# EAGLE design CIC_Arduino_Adapter (EAGLE 6.1)
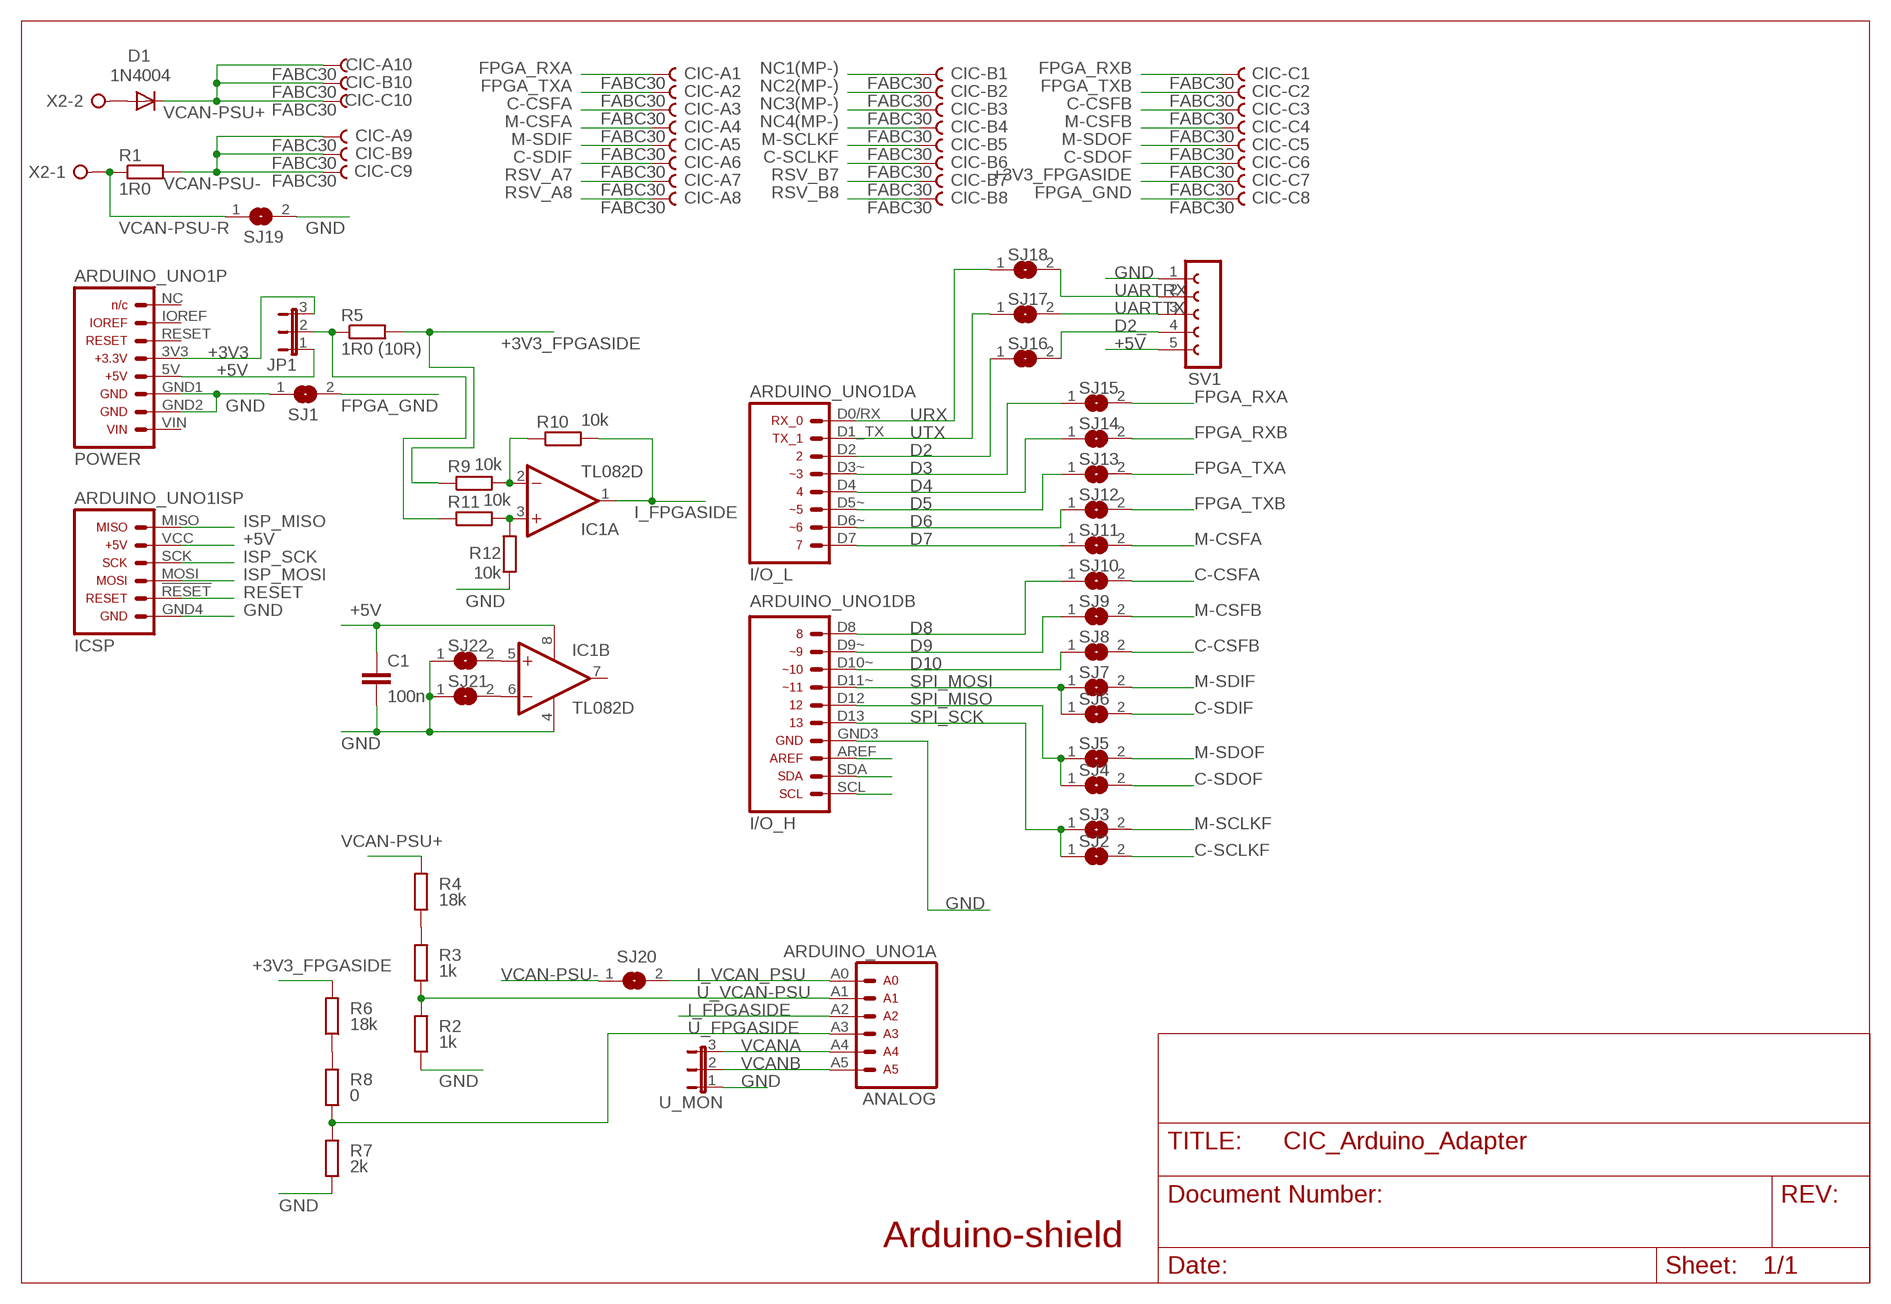
[diagram p0: schematic, sheet 1]

## Parts
ARDUINO_UNO1  SHELL_UNO1  [SHELL_UNO_1]
C1  100n  C-EUC0805  [C0805]
CIC  FABC30  [FABC30]
D1  1N4004  [DO41-10]
IC1  TL082D  [SO08]
JP1  JP2E  [JP2]
R1  1R0  R-EU_0207/2V  [0207/2V]
R2  1k  R-EU_0207/2V  [0207/2V]
R3  1k  R-EU_0207/2V  [0207/2V]
R4  18k  R-EU_0207/2V  [0207/2V]
R5  1R0 (10R)  R-EU_0207/2V  [0207/2V]
R6  18k  R-EU_0207/2V  [0207/2V]
R7  2k  R-EU_0207/2V  [0207/2V]
R8  0  R-EU_0207/2V  [0207/2V]
R9  10k  R-EU_R0805  [R0805]
R10  10k  R-EU_R0805  [R0805]
R11  10k  R-EU_R0805  [R0805]
R12  10k  R-EU_R0805  [R0805]
SJ1  SJ  [SJ]
SJ2  SJ  [SJ]
SJ3  SJ  [SJ]
SJ4  SJ  [SJ]
SJ5  SJ  [SJ]
SJ6  SJ  [SJ]
SJ7  SJ  [SJ]
SJ8  SJ  [SJ]
SJ9  SJ  [SJ]
SJ10  SJ  [SJ]
SJ11  SJ  [SJ]
SJ12  SJ  [SJ]
SJ13  SJ  [SJ]
SJ14  SJ  [SJ]
SJ15  SJ  [SJ]
SJ16  SJ  [SJ]
SJ17  SJ  [SJ]
SJ18  SJ  [SJ]
SJ19  SJ  [SJ]
SJ20  SJ  [SJ]
SJ21  SJ  [SJ]
SJ22  SJ  [SJ]
SV1  FE05-1  [FE05-1]
U_MON  JP2E  [JP2]
X2  W237-2N  [W237-2N]

## Nets
+3V3: ARDUINO_UNO1.3V3 JP1.3
+3V3_FPGASIDE: CIC.C7 R5.2 R6.2 R9.1
+5V: ARDUINO_UNO1.5V ARDUINO_UNO1.VCC C1.1 IC1.8(P:V+) JP1.1 SV1.5
C-CSFA: CIC.A3 SJ10.2
C-CSFB: CIC.C3 SJ8.2
C-SCLKF: CIC.B6 SJ2.2
C-SDIF: CIC.A6 SJ6.2
C-SDOF: CIC.C6 SJ4.2
D2: ARDUINO_UNO1.D2 SJ16.1
D2_: SJ16.2 SV1.4
D3: ARDUINO_UNO1.D3~ SJ15.1
D4: ARDUINO_UNO1.D4 SJ14.1
D5: ARDUINO_UNO1.D5~ SJ13.1
D6: ARDUINO_UNO1.D6~ SJ12.1
D7: ARDUINO_UNO1.D7 SJ11.1
D8: ARDUINO_UNO1.D8 SJ10.1
D9: ARDUINO_UNO1.D9~ SJ9.1
D10: ARDUINO_UNO1.D10~ SJ8.1
FPGA_GND: CIC.C8 SJ1.2
FPGA_RXA: CIC.A1 SJ15.2
FPGA_RXB: CIC.C1 SJ14.2
FPGA_TXA: CIC.A2 SJ13.2
FPGA_TXB: CIC.C2 SJ12.2
GND: ARDUINO_UNO1.GND1 ARDUINO_UNO1.GND2 ARDUINO_UNO1.GND3 ARDUINO_UNO1.GND4 C1.2 IC1.4(P:V-) R2.1 R7.1 R12.1 SJ1.1 SJ19.2 SJ21.1 SJ22.1 SV1.1 U_MON.1
I_FPGASIDE: ARDUINO_UNO1.A2 IC1.1(A:OUT) R10.2
I_VCAN_PSU: ARDUINO_UNO1.A0 SJ20.2
ISP_MISO: ARDUINO_UNO1.MISO
ISP_MOSI: ARDUINO_UNO1.MOSI
ISP_SCK: ARDUINO_UNO1.SCK
M-CSFA: CIC.A4 SJ11.2
M-CSFB: CIC.C4 SJ9.2
M-SCLKF: CIC.B5 SJ3.2
M-SDIF: CIC.A5 SJ7.2
M-SDOF: CIC.C5 SJ5.2
N$1: IC1.2(A:-IN) R9.2 R10.1
N$2: JP1.2 R5.1 R11.1
N$3: R6.1 R8.2
N$4: IC1.3(A:+IN) R11.2 R12.2
N$8: IC1.6(B:-IN) SJ21.2
N$9: IC1.5(B:+IN) SJ22.2
N$10: R3.2 R4.1
N$23: ARDUINO_UNO1.SCL
N$24: ARDUINO_UNO1.SDA
N$25: ARDUINO_UNO1.AREF
N$39: D1.A X2.2
NC1(MP-): CIC.B1
NC2(MP-): CIC.B2
NC3(MP-): CIC.B3
NC4(MP-): CIC.B4
RESET: ARDUINO_UNO1.!RESET
RSV_A7: CIC.A7
RSV_A8: CIC.A8
RSV_B7: CIC.B7
RSV_B8: CIC.B8
SPI_MISO: ARDUINO_UNO1.D12 SJ4.1 SJ5.1
SPI_MOSI: ARDUINO_UNO1.D11~ SJ6.1 SJ7.1
SPI_SCK: ARDUINO_UNO1.D13 SJ2.1 SJ3.1
U_FPGASIDE: ARDUINO_UNO1.A3 R7.2 R8.1
U_VCAN-PSU: ARDUINO_UNO1.A1 R2.2 R3.1
UARTRX: SJ18.2 SV1.2
UARTTX: SJ17.2 SV1.3
URX: ARDUINO_UNO1.D0/RX SJ18.1
UTX: ARDUINO_UNO1.D1_TX SJ17.1
VCAN-PSU+: CIC.A10 CIC.B10 CIC.C10 D1.C R4.2
VCAN-PSU-: CIC.A9 CIC.B9 CIC.C9 R1.2 SJ20.1
VCAN-PSU-R: R1.1 SJ19.1 X2.1
VCANA: ARDUINO_UNO1.A4 U_MON.3
VCANB: ARDUINO_UNO1.A5 U_MON.2
Unconnected: ARDUINO_UNO1.IOREF ARDUINO_UNO1.NC ARDUINO_UNO1.RESET ARDUINO_UNO1.VIN IC1.7(B:OUT)

## Notes on the sheet
- Arduino-shield

## Library data of the parts
ARDUINO_UNO1 = arduino_jw:SHELL_UNO1
C1 = rcl:C-EU: CAPACITOR, European symbol
CIC = con-vg:FABC30: Female Connector C/3, 30 Solder DIN EN 60 603-02 Source: www.erni.com .. 254891.pdf
D1 = diode:1N4004: DIODE general purpose rectifier, 1 A
IC1 = linear:TL082: OP AMP
JP1 U_MON = jumper:JP2E: JUMPER
R1-R12 = rcl:R-EU_: RESISTOR, European symbol
SJ1-SJ22 = jumper:SJ: SMD solder JUMPER
SV1 = con-lsta:FE05-1: FEMALE HEADER; OC_FARNELL: unknown; OC_NEWARK: unknown
X2 = con-wago-508:W237-2N: WAGO SREW CLAMP; OC_FARNELL: unknown; OC_NEWARK: unknown

## Board
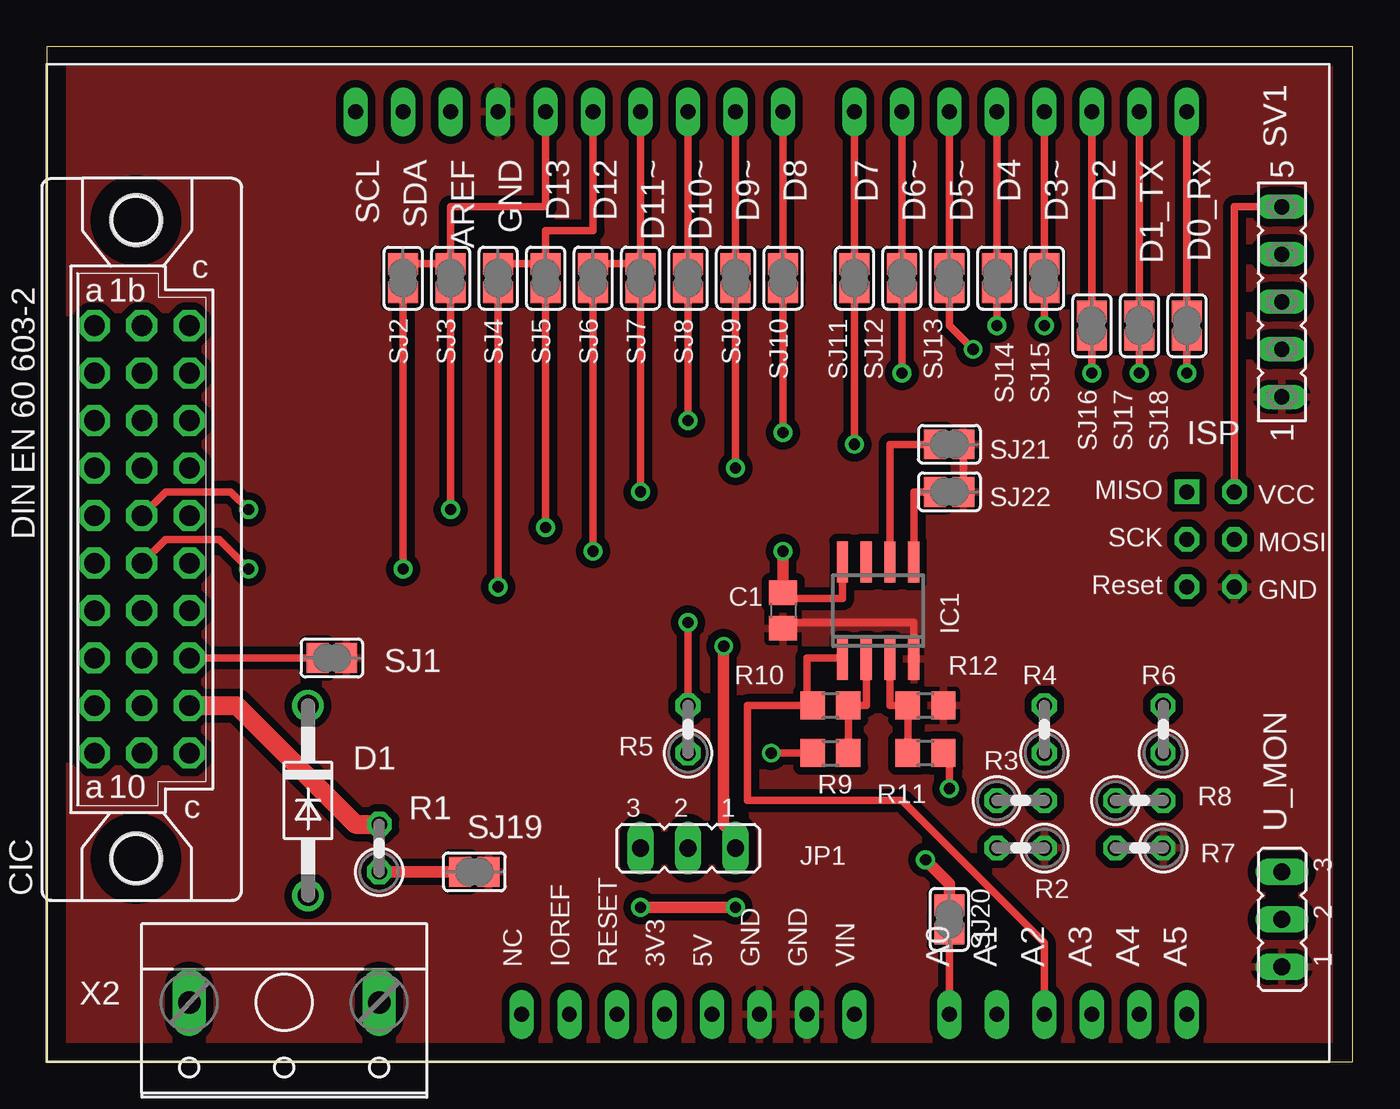
[diagram p1: board, top side]
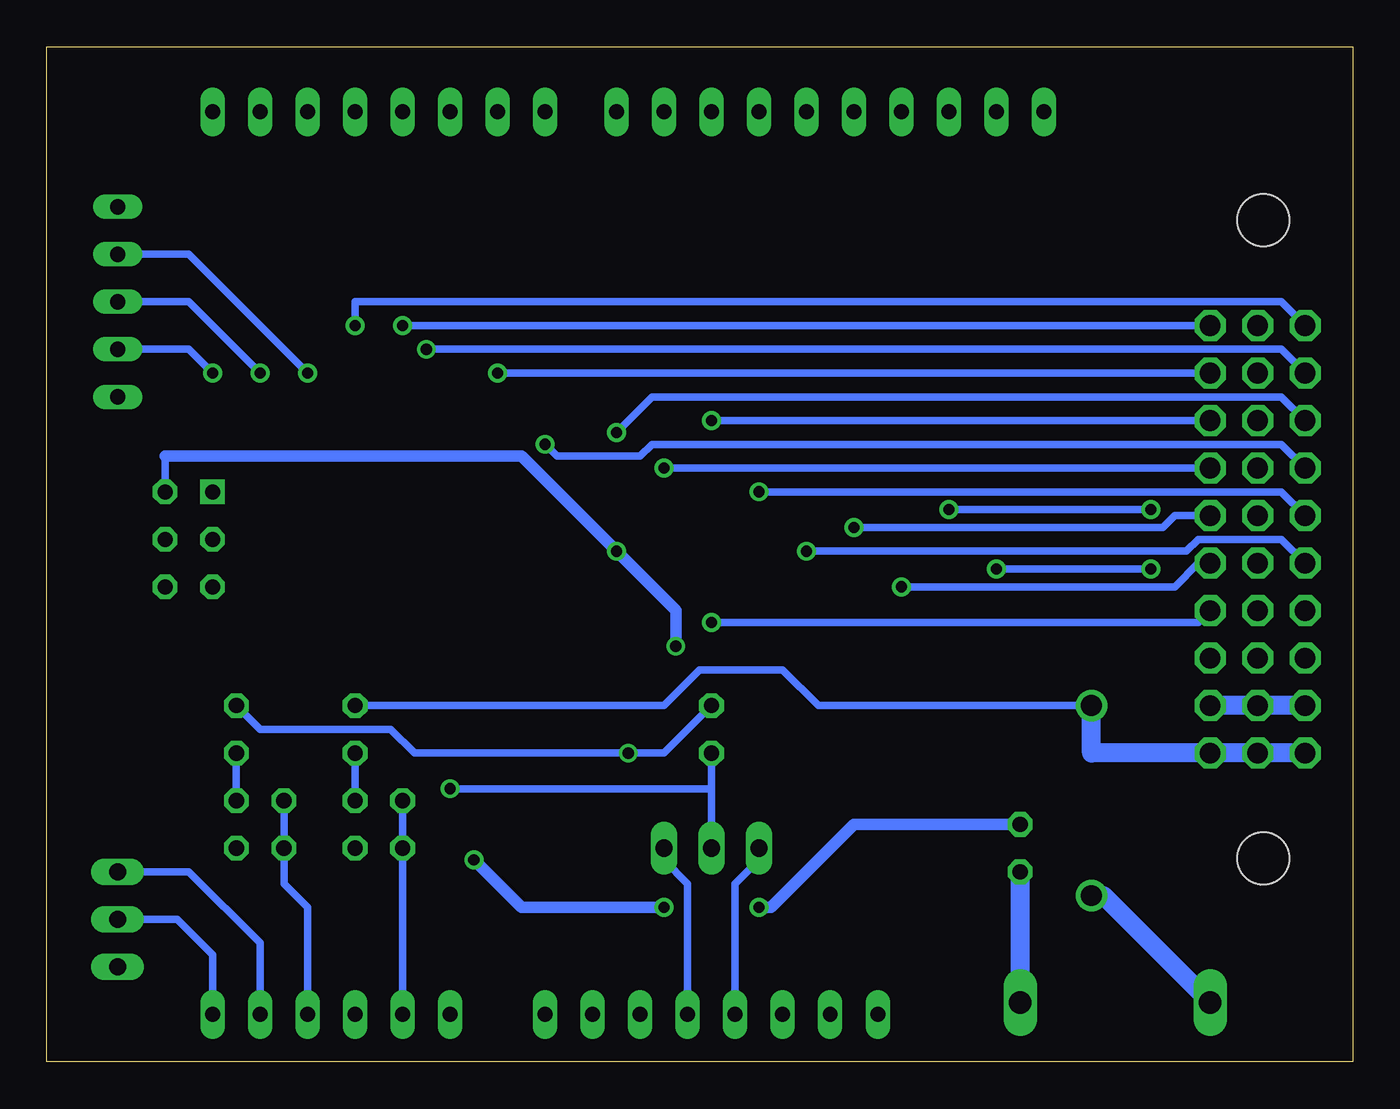
[diagram p2: board, bottom side, seen from below]

Size 69.83 x 54.28 mm. Coordinates in mm from the lower left corner, seen from the top.
Outline: 0,0 69.83,0 69.83,54.28 0,54.28 0,0
Copper layers (1*16): Top 0.035mm / dielectric 1.5mm / Bottom 0.035mm
Design rules: minimum track width 10mil, minimum drill 23mil, track to track 8mil, track to pad 8mil, pad to pad 8mil, via to via 8mil, smd to smd 8mil, copper to edge 40mil, drill to drill 8mil, minimum pad ring 10mil, minimum via ring 8mil, stop-mask expansion 4mil, vias tented up to drill 0mil, thermal gap 10mil

### Footprints (pad centres in the part's own frame; a part is rotated, then mirrored left to right if it is on the bottom)
SHELL_UNO_1 = drill 0.8 long: 3V3 33.02,2.54; 5V 35.56,2.54; A0 48.26,2.54; A1 50.8,2.54; A2 53.34,2.54; A3 55.88,2.54; A4 58.42,2.54; A5 60.96,2.54; AREF 21.59,50.8; D0/RX 60.96,50.8; D1_TX 58.42,50.8; D2 55.88,50.8; D3~ 53.34,50.8; D4 50.8,50.8; D5~ 48.26,50.8; D6~ 45.72,50.8; D7 43.18,50.8; D8 39.37,50.8; D9~ 36.83,50.8; D10~ 34.29,50.8; D11~ 31.75,50.8; D12 29.21,50.8; D13 26.67,50.8; GND1 38.1,2.54; GND2 40.64,2.54; GND3 24.13,50.8; IOREF 27.94,2.54; NC 25.4,2.54; RESET 30.48,2.54; SCL 16.51,50.8; SDA 19.05,50.8; VIN 43.18,2.54 | drill 0.8 octagon: !RESET 60.96,25.4; GND4 63.5,25.4; MOSI 63.5,27.94; SCK 60.96,27.94; VCC 63.5,30.48 | drill 0.8 square: MISO 60.96,30.48
C0805 = smd 1.3 x 1.5: 1 -0.95,0; 2 0.95,0
FABC30 = drill 1.1 pad 1.6 octagon: A1 -2.54,11.43; A2 -2.54,8.89; A3 -2.54,6.35; A4 -2.54,3.81; A5 -2.54,1.27; A6 -2.54,-1.27; A7 -2.54,-3.81; A8 -2.54,-6.35; A9 -2.54,-8.89; A10 -2.54,-11.43; B1 0,11.43; B2 0,8.89; B3 0,6.35; B4 0,3.81; B5 0,1.27; B6 0,-1.27; B7 0,-3.81; B8 0,-6.35; B9 0,-8.89; B10 0,-11.43; C1 2.54,11.43; C2 2.54,8.89; C3 2.54,6.35; C4 2.54,3.81; C5 2.54,1.27; C6 2.54,-1.27; C7 2.54,-3.81; C8 2.54,-6.35; C9 2.54,-8.89; C10 2.54,-11.43 | hole 2.794: -0.305,17.069; -0.305,-17.069
DO41-10 = drill 1.118: A 5.08,0; C -5.08,0
SO08 = smd 0.6 x 2.2: 1 -1.905,-2.6; 2 -0.635,-2.6; 3 0.635,-2.6; 4 1.905,-2.6; 5 1.905,2.6; 6 0.635,2.6; 7 -0.635,2.6; 8 -1.905,2.6
JP2 = drill 0.914 long: 1 -2.54,0; 2 0,0; 3 2.54,0
0207/2V = drill 0.813 octagon: 1 -1.27,0; 2 1.27,0
R0805 = smd 1.3 x 1.5: 1 -0.95,0; 2 0.95,0
SJ = smd 1.168 x 1.6: 1 -0.762,0; 2 0.762,0
FE05-1 = drill 0.813 long: 1 -5.08,0; 2 -2.54,0; 3 0,0; 4 2.54,0; 5 5.08,0
W237-2N = drill 1.194 long: 1 -5.08,-0.635; 2 5.08,-0.635

### Placement (x,y rotation side)
ARDUINO_UNO1  0,0 0 top
C1  39.37,24.13 270 top
CIC  5.08,27.94 0 top
D1  13.97,13.97 270 top
IC1  44.45,24.13 0 top
JP1  34.29,11.43 180 top
R1  17.78,11.43 90 top
R2  52.07,11.43 180 top
R3  52.07,13.97 0 top
R4  53.34,17.78 90 top
R5  34.29,17.78 90 top
R6  59.69,17.78 90 top
R7  58.42,11.43 180 top
R8  58.42,13.97 0 top
R9  41.91,16.51 0 top
R10  41.91,19.05 180 top
R11  46.99,16.51 180 top
R12  46.99,19.05 180 top
SJ1  15.24,21.59 180 top
SJ2  19.05,41.91 270 top
SJ3  21.59,41.91 270 top
SJ4  24.13,41.91 270 top
SJ5  26.67,41.91 270 top
SJ6  29.21,41.91 270 top
SJ7  31.75,41.91 270 top
SJ8  34.29,41.91 270 top
SJ9  36.83,41.91 270 top
SJ10  39.37,41.91 270 top
SJ11  43.18,41.91 270 top
SJ12  45.72,41.91 270 top
SJ13  48.26,41.91 270 top
SJ14  50.8,41.91 270 top
SJ15  53.34,41.91 270 top
SJ16  55.88,39.37 270 top
SJ17  58.42,39.37 270 top
SJ18  60.96,39.37 270 top
SJ19  22.86,10.16 0 top
SJ20  48.26,7.62 270 top
SJ21  48.26,33.02 180 top
SJ22  48.26,30.48 180 top
SV1  66.04,40.64 90 top
U_MON  66.04,7.62 90 top
X2  12.7,2.54 180 top

### Tracks (layer width: path | path; a pad name or v marks a point on that pad's centre or on a via)
+3V3
  Bottom 0.406: ARDUINO_UNO1.3V3 33.02,9.53 31.75,10.79 JP1.3
+3V3_FPGASIDE  (via drill 0.6)
  Top 0.406: v38.73,16.51 R9.1 | v34.29,23.5 R5.2
  Bottom 0.406: R5.2 36.83,16.51 v38.73,16.51 50.16,16.51 51.44,17.78 58.42,17.78 R6.2 | CIC.C7 8.26,23.5 v34.29,23.5
+5V  (via drill 0.6)
  Top 0.406: SV1.5 63.5,45.72 ARDUINO_UNO1.VCC | C1.1 39.69,24.77 42.55,24.77 IC1.8
  Top 0.61: v39.37,27.3 C1.1 | JP1.1 36.83,12.06 36.2,12.7 v36.2,22.23
  Bottom 0.406: ARDUINO_UNO1.5V 35.56,9.53 36.83,10.79 JP1.1 | ARDUINO_UNO1.VCC 63.5,32.38
  Bottom 0.61: 63.5,32.38 44.45,32.38 v39.37,27.3 36.2,24.13 v36.2,22.23
C-CSFA  (via drill 0.6)
  Top 0.406: SJ10.2 v39.37,33.66
  Bottom 0.406: CIC.A3 3.81,35.56 37.47,35.56 v39.37,33.66
C-CSFB  (via drill 0.6)
  Top 0.406: SJ8.2 v34.29,34.29
  Bottom 0.406: v34.29,34.29 CIC.C3
C-SCLKF  (via drill 0.6)
  Top 0.406: CIC.B6 6.35,27.94 9.21,27.94 v10.79,26.35 | SJ2.2 v19.05,26.35
  Bottom 0.406: v19.05,26.35 v10.79,26.35
C-SDIF  (via drill 0.6)
  Top 0.406: SJ6.2 v29.21,27.3
  Bottom 0.406: CIC.A6 3.81,27.94 8.26,27.94 8.89,27.3 v29.21,27.3
C-SDOF  (via drill 0.6)
  Top 0.406: SJ4.2 v24.13,25.4
  Bottom 0.406: CIC.C6 8.26,26.67 9.53,25.4 v24.13,25.4
D2
  Top 0.406: SJ16.1 ARDUINO_UNO1.D2
D2_  (via drill 0.6)
  Top 0.406: SJ16.2 v55.88,36.83
  Bottom 0.406: v55.88,36.83 62.23,43.18 SV1.4
D3
  Top 0.406: SJ15.1 ARDUINO_UNO1.D3~
D4
  Top 0.406: SJ14.1 ARDUINO_UNO1.D4
D5
  Top 0.406: SJ13.1 ARDUINO_UNO1.D5~
D6
  Top 0.406: SJ12.1 ARDUINO_UNO1.D6~
D7
  Top 0.406: SJ11.1 ARDUINO_UNO1.D7
D8
  Top 0.406: SJ10.1 ARDUINO_UNO1.D8
D9
  Top 0.406: SJ9.1 ARDUINO_UNO1.D9~
D10
  Top 0.406: SJ8.1 ARDUINO_UNO1.D10~
FPGA_GND
  Top 0.406: SJ1.2 CIC.C8
FPGA_RXA  (via drill 0.6)
  Top 0.406: SJ15.2 v53.34,39.37
  Bottom 0.406: CIC.A1 3.81,40.64 53.34,40.64 v53.34,39.37 53.34,39.05
FPGA_RXB  (via drill 0.6)
  Top 0.406: v50.8,39.37 SJ14.2
  Bottom 0.406: CIC.C1 v50.8,39.37
FPGA_TXA  (via drill 0.6)
  Top 0.406: SJ13.2 48.26,39.37 v49.53,38.1
  Bottom 0.406: CIC.A2 3.81,38.1 v49.53,38.1
FPGA_TXB  (via drill 0.6)
  Top 0.406: SJ12.2 v45.72,36.83
  Bottom 0.406: CIC.C2 v45.72,36.83
GND
  Top 0.406: C1.2 39.69,23.5 46.35,23.5 IC1.4 | SJ21.1 SJ22.1
  pour Top (isolate 0.406): 0,53.34 0,0 68.58,0 68.58,53.34
I_FPGASIDE
  Top 0.406: IC1.1 42.48,21.59 40.64,21.59 40.64,19.37 R10.2 37.47,19.05 37.47,13.97 45.72,13.97 53.34,6.35 ARDUINO_UNO1.A2
I_VCAN_PSU
  Top 0.406: SJ20.2 ARDUINO_UNO1.A0
M-CSFA  (via drill 0.6)
  Top 0.406: SJ11.2 v43.18,33.02
  Bottom 0.406: CIC.A4 3.81,33.02 37.47,33.02 38.1,32.38 42.55,32.38 v43.18,33.02
M-CSFB  (via drill 0.6)
  Top 0.406: SJ9.2 v36.83,31.75
  Bottom 0.406: CIC.C4 v36.83,31.75
M-SCLKF  (via drill 0.6)
  Top 0.406: CIC.B5 6.35,30.48 9.84,30.48 v10.79,29.53 | SJ3.2 v21.59,29.53
  Bottom 0.406: v21.59,29.53 v10.79,29.53
M-SDIF  (via drill 0.6)
  Top 0.406: SJ7.2 v31.75,30.48
  Bottom 0.406: CIC.A5 3.81,30.48 v31.75,30.48
M-SDOF  (via drill 0.6)
  Top 0.406: SJ5.2 v26.67,28.57
  Bottom 0.406: CIC.C5 9.53,29.21 10.16,28.57 v26.67,28.57
N$1
  Top 0.406: IC1.2 43.81,19.05 R10.1 R9.2
N$2  (via drill 0.6)
  Top 0.406: R11.1 48.26,16.19 v48.26,14.61
  Bottom 0.406: v48.26,14.61 34.29,14.61 R5.1 JP1.2
N$3
  Bottom 0.406: R8.2 R6.1
N$4
  Top 0.406: IC1.3 45.09,19.05 R12.2 R11.2
N$8
  Top 0.406: SJ21.2 45.09,33.02 IC1.6
N$9
  Top 0.406: SJ22.2 46.35,30.48 IC1.5
N$10
  Bottom 0.406: R3.2 R4.1
N$39
  Bottom 1.016: X2.2 13.34,8.89 D1.A
SPI_MISO
  Top 0.406: SJ5.1 26.67,43.18 | 26.67,43.18 26.67,44.45 29.21,44.45 ARDUINO_UNO1.D12 | SJ4.1 26.16,42.67 26.67,43.18
SPI_MOSI
  Top 0.406: ARDUINO_UNO1.D11~ 31.75,43.18 SJ7.1 SJ6.1
SPI_SCK
  Top 0.406: SJ3.1 21.59,43.18 | 21.59,43.18 21.59,45.72 26.67,45.72 ARDUINO_UNO1.D13 | SJ2.1 21.08,42.67 21.59,43.18
U_FPGASIDE
  Bottom 0.406: ARDUINO_UNO1.A3 55.88,8.26 57.15,9.53 R7.2 R8.1
U_VCAN-PSU
  Bottom 0.406: ARDUINO_UNO1.A1 R2.2 R3.1
UARTRX  (via drill 0.6)
  Top 0.406: SJ18.2 v60.96,36.83
  Bottom 0.406: v60.96,36.83 62.23,38.1 SV1.2
UARTTX  (via drill 0.6)
  Top 0.406: SJ17.2 v58.42,36.83
  Bottom 0.406: v58.42,36.83 62.23,40.64 SV1.3
URX
  Top 0.406: SJ18.1 ARDUINO_UNO1.D0/RX
UTX
  Top 0.406: SJ17.1 ARDUINO_UNO1.D1_TX
VCAN-PSU+
  Bottom 0.406: D1.C 28.57,19.05 30.48,20.95 34.92,20.95 36.83,19.05 R4.2
  Bottom 1.016: CIC.A10 CIC.B10 CIC.C10 13.97,16.51 D1.C
VCAN-PSU-  (via drill 0.6)
  Top 0.61: v31.75,8.26 v36.83,8.26 | v46.99,10.79 48.26,9.53 SJ20.1
  Top 1.016: CIC.C9 10.16,19.05 16.51,12.7 R1.2
  Bottom 0.61: R1.2 26.67,12.7 31.11,8.26 v31.75,8.26 | v36.83,8.26 44.45,8.26 v46.99,10.79
  Bottom 1.016: CIC.A9 CIC.B9 CIC.C9
VCAN-PSU-R
  Top 0.61: SJ19.1 R1.1
  Bottom 1.016: X2.1 R1.1
VCANA
  Bottom 0.406: U_MON.3 62.23,10.16 58.42,6.35 ARDUINO_UNO1.A4
VCANB
  Bottom 0.406: U_MON.2 62.87,7.62 60.96,5.71 ARDUINO_UNO1.A5